# EAGLE schematic jobygnss_v2.1_final (EAGLE 5.11)

## Sheet 1 of 3
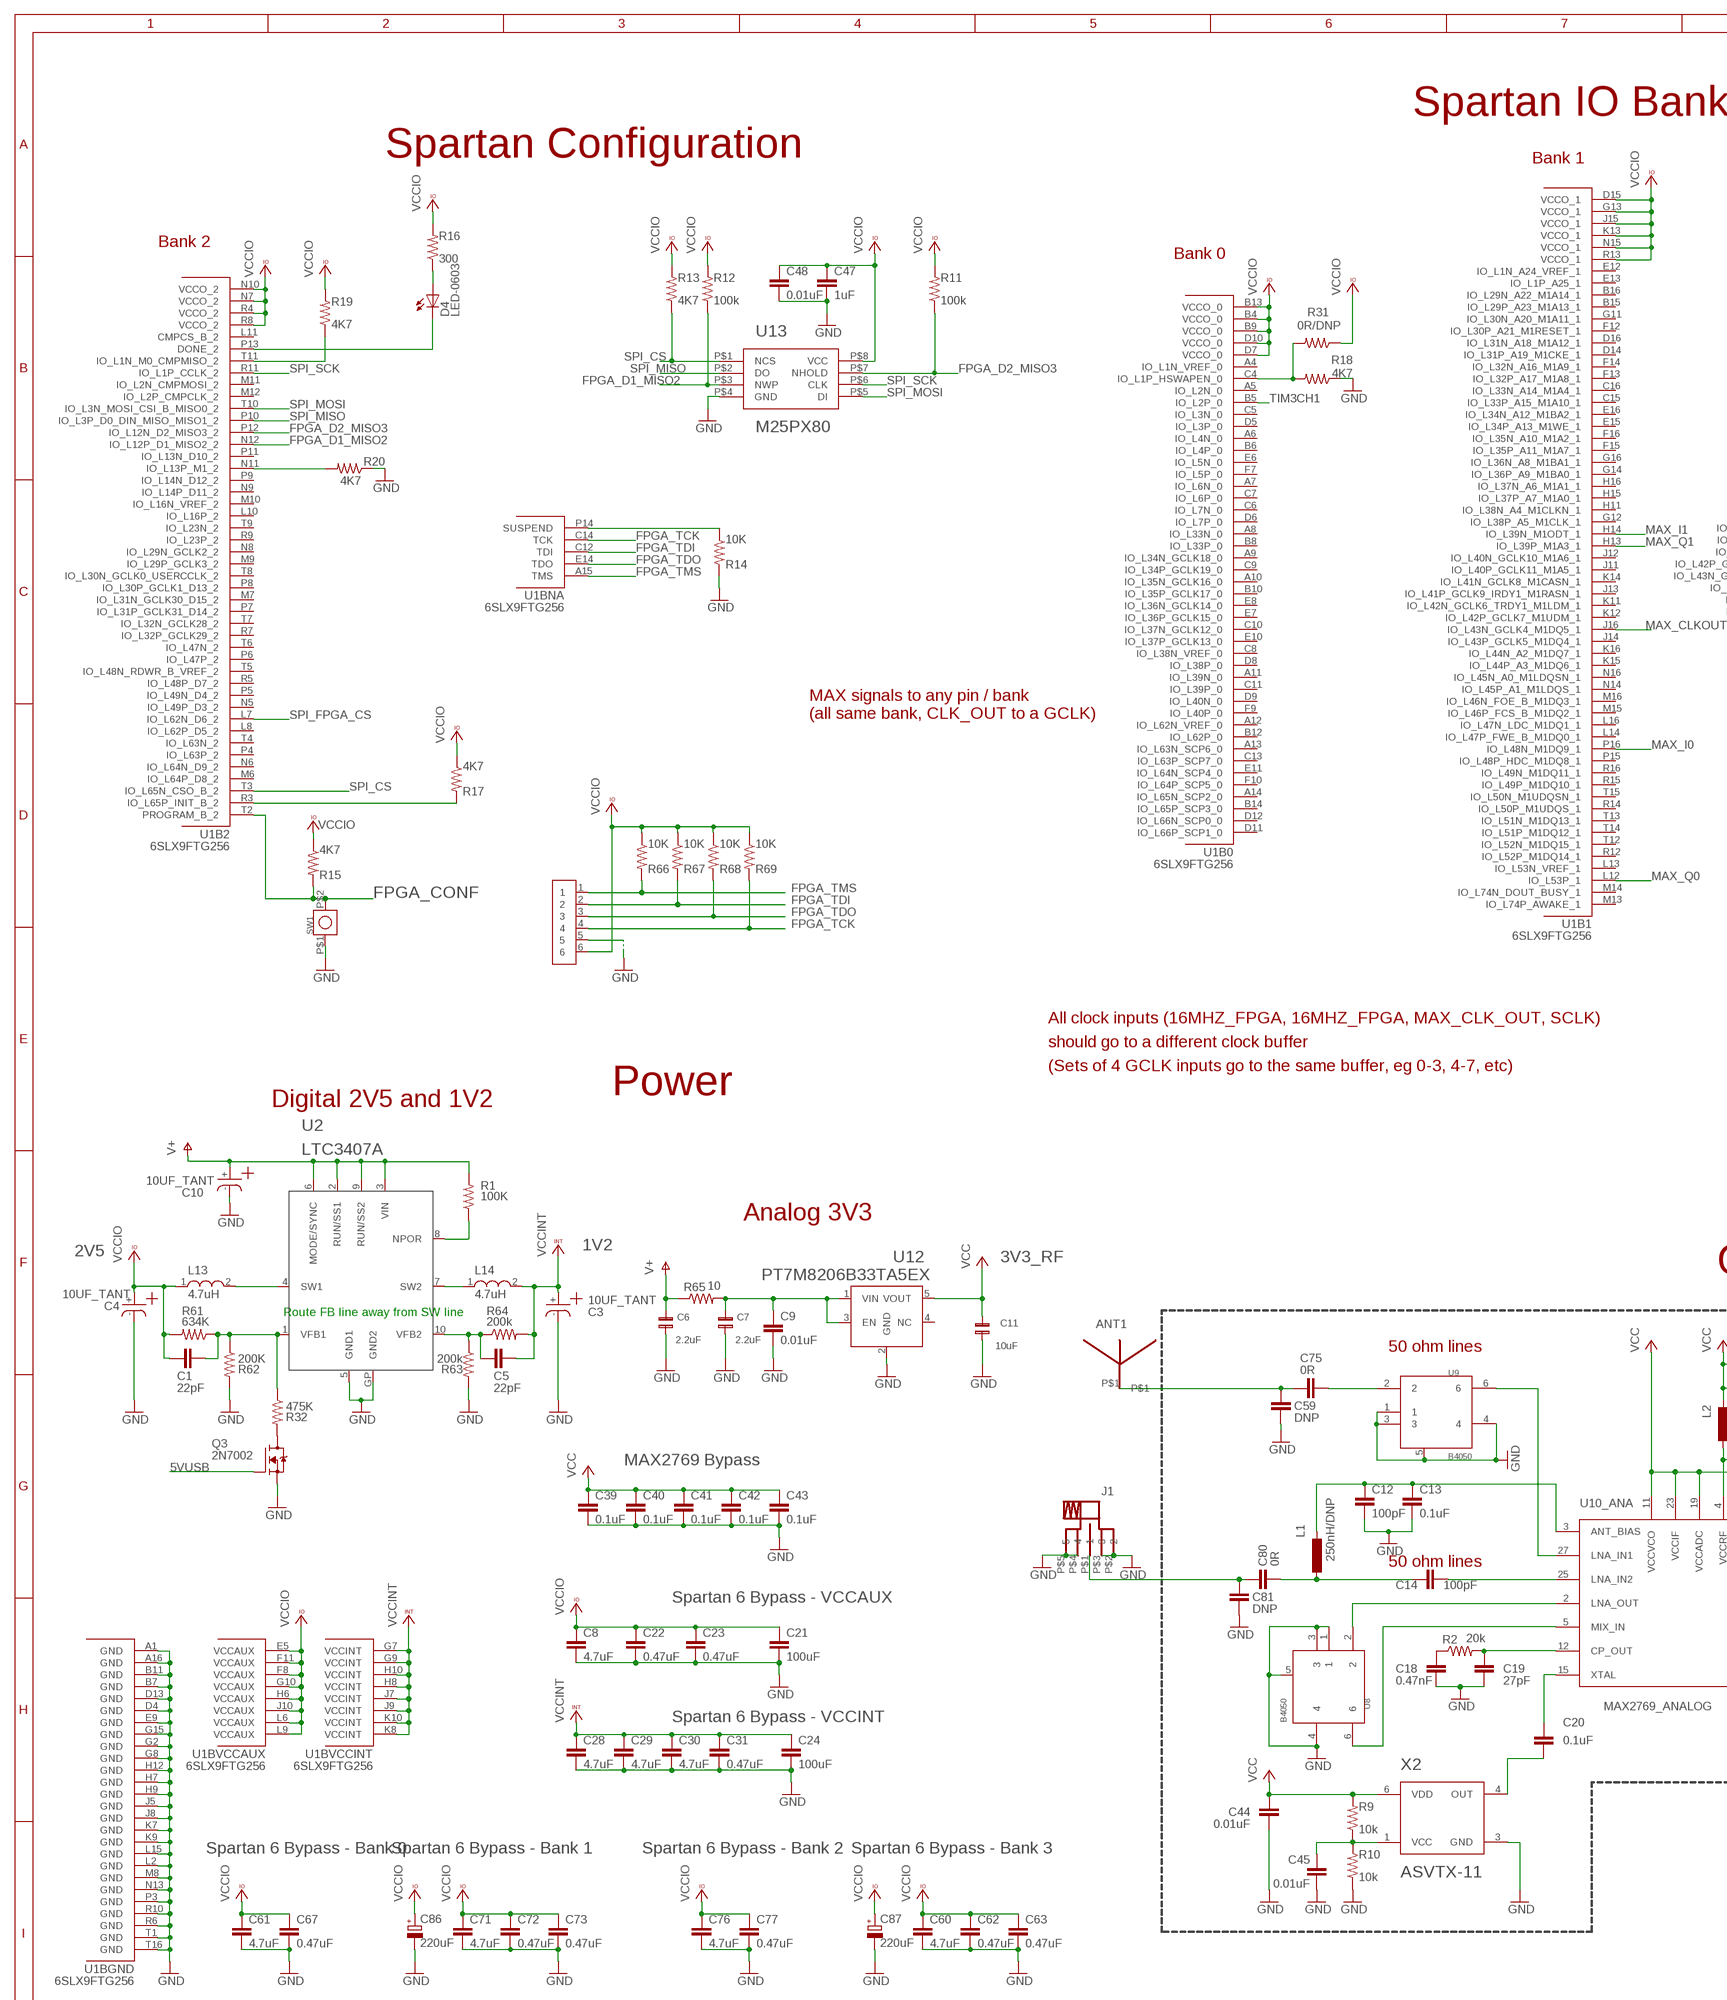
[diagram p0: schematic, sheet 1, part 1 of 2]
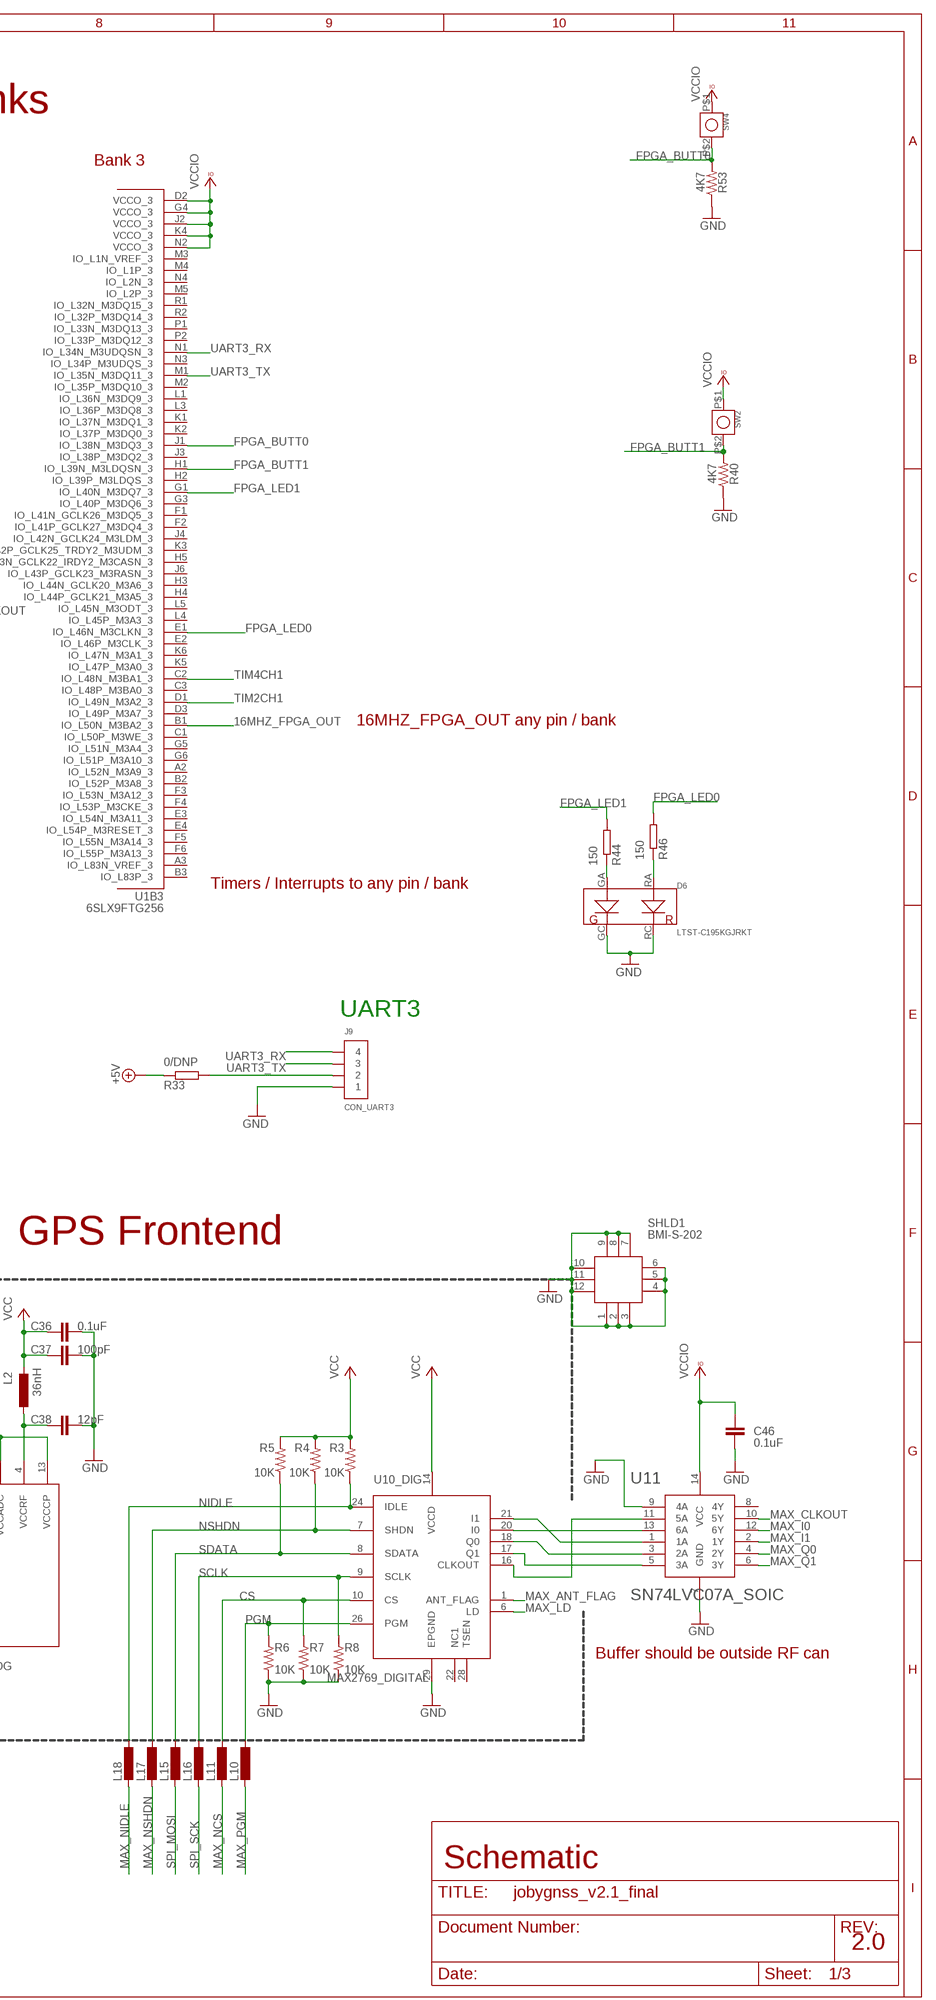
[diagram p1: schematic, sheet 1, part 2 of 2]

### Parts
ANT1  GPS_PATCH_ANTENNA  [GPS_PATCH_ANTENNA]
C1  22pF  C-EUC0402  [C0402]
C3  10UF_TANT  [CT7343]
C4  10UF_TANT  [CT7343]
C5  22pF  C-EUC0402  [C0402]
C6  2.2uF  C0603  [0603]
C7  2.2uF  C0603  [0603]
C8  4.7uF  C-EUC0603K  [C0603K]
C9  0.01uF  C-EUC0402  [C0402]
C10  10UF_TANT  [CT7343]
C11  10uF  C0603  [0603]
C12  100pF  C-EUC0402  [C0402]
C13  0.1uF  C-EUC0402  [C0402]
C14  100pF  C-EUC0402  [C0402]
C18  0.47nF  C-EUC0402  [C0402]
C19  27pF  C-EUC0402  [C0402]
C20  0.1uF  C-EUC0402  [C0402]
C21  100uF  C-EUC1210K  [C1210K]
C22  0.47uF  C-EUC0402  [C0402]
C23  0.47uF  C-EUC0402  [C0402]
C24  100uF  C-EUC1210K  [C1210K]
C28  4.7uF  C-EUC0603K  [C0603K]
C29  4.7uF  C-EUC0603K  [C0603K]
C30  4.7uF  C-EUC0603K  [C0603K]
C31  0.47uF  C-EUC0402  [C0402]
C36  0.1uF  C-EUC0402  [C0402]
C37  100pF  C-EUC0402  [C0402]
C38  12pF  C-EUC0402  [C0402]
C39  0.1uF  C-EUC0402  [C0402]
C40  0.1uF  C-EUC0402  [C0402]
C41  0.1uF  C-EUC0402  [C0402]
C42  0.1uF  C-EUC0402  [C0402]
C43  0.1uF  C-EUC0402  [C0402]
C44  0.01uF  C-EUC0402  [C0402]
C45  0.01uF  C-EUC0402  [C0402]
C46  0.1uF  C-EUC0402  [C0402]
C47  1uF  C-EUC0402  [C0402]
C48  0.01uF  C-EUC0402  [C0402]
C59  DNP  C-EUC0402  [C0402]
C60  4.7uF  C-EUC0603K  [C0603K]
C61  4.7uF  C-EUC0603K  [C0603K]
C62  0.47uF  C-EUC0402  [C0402]
C63  0.47uF  C-EUC0402  [C0402]
C67  0.47uF  C-EUC0402  [C0402]
C71  4.7uF  C-EUC0603K  [C0603K]
C72  0.47uF  C-EUC0402  [C0402]
C73  0.47uF  C-EUC0402  [C0402]
C75  0R  C-EUC0402  [C0402]
C76  4.7uF  C-EUC0603K  [C0603K]
C77  0.47uF  C-EUC0402  [C0402]
C80  0R  C-EUC0402  [C0402]
C81  DNP  C-EUC0402  [C0402]
C86  220uF  CAPACITOR-POLC  [6032/C]
C87  220uF  CAPACITOR-POLC  [6032/C]
D4  LED-0603  [0603-LED]
D6  LTST-C195KGJRKT  [LTST-C195KGJRKT]
J1  SMA  [SMA]
J2  6_PIN_100MIL  [SSW-106-02-S-S]
J9  CON_UART3  CONN_4-1-53398  [PB-53398-04]
L1  250nH/DNP  INDUCTOR-0402  [0402-IND]
L2  36nH  INDUCTOR-0402  [0402-IND]
L10  INDUCTOR-0402  [0402-IND]
L11  INDUCTOR-0402  [0402-IND]
L13  4.7uH  LQM2HPN4R7MG0L  [LQM2HPN4R7MG0L]
L14  4.7uH  LQM2HPN4R7MG0L  [LQM2HPN4R7MG0L]
L15  INDUCTOR-0402  [0402-IND]
L16  INDUCTOR-0402  [0402-IND]
L17  INDUCTOR-0402  [0402-IND]
L18  INDUCTOR-0402  [0402-IND]
Q3  2N7002  [2N7002]
R1  100K  R-US_R0402  [R0402]
R2  20k  R-US_R0402  [R0402]
R3  10K  R-US_R0402  [R0402]
R4  10K  R-US_R0402  [R0402]
R5  10K  R-US_R0402  [R0402]
R6  10K  R-US_R0402  [R0402]
R7  10K  R-US_R0402  [R0402]
R8  10K  R-US_R0402  [R0402]
R9  10k  R-US_R0402  [R0402]
R10  10k  R-US_R0402  [R0402]
R11  100k  R-US_R0402  [R0402]
R12  100k  R-US_R0402  [R0402]
R13  4K7  R-US_R0402  [R0402]
R14  10K  R-US_R0402  [R0402]
R15  4K7  R-US_R0402  [R0402]
R16  300  R-US_R0402  [R0402]
R17  4K7  R-US_R0402  [R0402]
R18  4K7  R-US_R0402  [R0402]
R19  4K7  R-US_R0402  [R0402]
R20  4K7  R-US_R0402  [R0402]
R31  0R/DNP  R-US_R0402  [R0402]
R32  475K  R-US_R0402  [R0402]
R33  0/DNP  RESISTOR-0402  [0402-RES]
R40  4K7  R-US_R0402  [R0402]
R44  150  RESISTOR-0402  [0402-RES]
R46  150  RESISTOR-0402  [0402-RES]
R53  4K7  R-US_R0402  [R0402]
R61  634K  R-US_R0402  [R0402]
R62  200K  R-US_R0402  [R0402]
R63  200k  R-US_R0402  [R0402]
R64  200k  R-US_R0402  [R0402]
R65  10  R-US_R0402  [R0402]
R66  10K  R-US_R0402  [R0402]
R67  10K  R-US_R0402  [R0402]
R68  10K  R-US_R0402  [R0402]
R69  10K  R-US_R0402  [R0402]
SHLD1  BMI-S-202  [BMI-S-202]
SW1  B3U-1000P  [B3U-1000P]
SW2  B3U-1000P  [B3U-1000P]
SW4  B3U-1000P  [B3U-1000P]
U1  6SLX9FTG256  [FT256]
U2  LTC3407A  [MSOP10]
U8  B4050  [B4050]
U9  B4050  [B4050]
U10  MAX2769  [MAX2769]
U11  SN74LVC07A_SOIC  [SN74LVC07A_SOIC]
U12  PT7M8206B33TA5EX  [PT7M8206B33TA5EX]
U13  M25PX80  M25P80-VMW6TG  [M25P]
X2  ASVTX-11  [ASVTX-11]

### Nets
5VUSB: Q3.G ; also sheet 3
16MHZ_FPGA_OUT: U1.B1(B3:IO_L50N_M3BA2_3) ; also sheet 3
+5V: R33.P$1 ; also sheet 3
CS: L11.P$1 R7.2 U10.10(_DIG:CS)
FE_CLK: C20.2 X2.4(OUT)
FPGA_BUTT0: R53.2 SW4.P$2 U1.J1(B3:IO_L38N_M3DQ3_3)
FPGA_BUTT1: R40.2 SW2.P$2 U1.H1(B3:IO_L39N_M3LDQSN_3)
FPGA_CONF: R15.2 SW1.P$2 U1.T2(B2:PROGRAM_B_2) ; also sheet 3
FPGA_D1_MISO2: R12.1 U1.N12(B2:IO_L12P_D1_MISO2_2) U13.P$3(NWP)
FPGA_D2_MISO3: R11.1 U1.P12(B2:IO_L12N_D2_MISO3_2) U13.P$7(NHOLD)
FPGA_LED0: R46.P$2 U1.E1(B3:IO_L46N_M3CLKN_3)
FPGA_LED1: R44.P$2 U1.G1(B3:IO_L40N_M3DQ7_3)
FPGA_M0: R19.1 U1.T11(B2:IO_L1N_M0_CMPMISO_2)
FPGA_M1: R20.2 U1.N11(B2:IO_L13P_M1_2)
FPGA_TCK: J2.4 R69.2 U1.C14(BNA:TCK)
FPGA_TDI: J2.2 R67.2 U1.C12(BNA:TDI)
FPGA_TDO: J2.3 R68.2 U1.E14(BNA:TDO)
FPGA_TMS: J2.1 R66.2 U1.A15(BNA:TMS)
GND: C3.- C4.- C6.1 C7.1 C8.2 C9.2 C10.- C11.1 C12.2 C13.2 C18.2 C19.2 C21.2 C22.2 C23.2 C24.2 C28.2 C29.2 C30.2 C31.2 C36.2 C37.2 C38.2 C39.2 C40.2 C41.2 C42.2 C43.2 C44.2 C45.2 C46.2 C47.2 C48.2 C59.1 C60.2 C61.2 C62.2 C63.2 C67.2 C71.2 C72.2 C73.2 C76.2 C77.2 C81.1 C86.- C87.- D6.GC D6.RC J1.P$2 J1.P$3 J1.P$4 J1.P$5 J2.5 J9.1 Q3.S R6.1 R7.1 R8.1 R10.1 R14.2 R18.1 R20.1 R40.1 R53.1 R62.2 R63.2 SHLD1.1 SHLD1.2 SHLD1.3 SHLD1.4 SHLD1.5 SHLD1.6 SHLD1.7 SHLD1.8 SHLD1.9 SHLD1.10 SHLD1.11 SHLD1.12 SW1.P$1 U1.A1(BGND:GND) U1.A16(BGND:GND) U1.B7(BGND:GND) U1.B11(BGND:GND) U1.D4(BGND:GND) U1.D13(BGND:GND) U1.E9(BGND:GND) U1.G2(BGND:GND) U1.G8(BGND:GND) U1.G15(BGND:GND) U1.H7(BGND:GND) U1.H9(BGND:GND) U1.H12(BGND:GND) U1.J5(BGND:GND) U1.J8(BGND:GND) U1.K7(BGND:GND) U1.K9(BGND:GND) U1.L2(BGND:GND) U1.L15(BGND:GND) U1.M8(BGND:GND) U1.N13(BGND:GND) U1.P3(BGND:GND) U1.R6(BGND:GND) U1.R10(BGND:GND) U1.T1(BGND:GND) U1.T16(BGND:GND) U2.5(GND1) U2.GP(GND2) U8.1 U8.3 U8.4 U8.5 U9.1 U9.3 U9.4 U9.5 U10.29(_DIG:EPGND) U11.7(GND) U11.9(4A) U12.2(GND) U13.P$4(GND) X2.3(GND) ; also sheet 3
MAX_ANT_FLAG: U10.1(_DIG:ANT_FLAG) ; also sheet 3
MAX_CLKOUT: U1.J16(B1:IO_L43N_GCLK4_M1DQ5_1) U11.10(5Y)
MAX_I0: U1.P16(B1:IO_L48N_M1DQ9_1) U11.12(6Y)
MAX_I1: U1.H14(B1:IO_L39N_M1ODT_1) U11.2(1Y)
MAX_LD: U10.6(_DIG:LD) ; also sheet 3
MAX_NCS: L11.P$2 ; also sheet 3
MAX_NIDLE: L18.P$2 ; also sheet 3
MAX_NSHDN: L17.P$2 ; also sheet 3
MAX_PGM: L10.P$2 ; also sheet 3
MAX_Q0: U1.L12(B1:IO_L53P_1) U11.4(2Y)
MAX_Q1: U1.H13(B1:IO_L39P_M1A3_1) U11.6(3Y)
N$3: C18.1 R2.1
N$4: C19.1 R2.2 U10.12(_ANA:CP_OUT)
N$5: U8.2 U10.2(_ANA:LNA_OUT)
N$6: C20.1 U10.15(_ANA:XTAL)
N$7: U8.6 U10.5(_ANA:MIX_IN)
N$8: C80.2 C81.2 J1.P$1
N$9: U10.18(_DIG:Q0) U11.3(2A)
N$10: C12.1 C13.1 L1.P$2 U10.3(_ANA:ANT_BIAS)
N$11: C75.1 U9.2
N$12: Q3.D R32.2
N$15: D4.C U1.P13(B2:DONE_2)
N$16: R1.1 U2.8(NPOR)
N$17: L13.2 U2.4(SW1)
N$18: J9.2 R33.P$2
N$19: D6.RA R46.P$1
N$20: U10.16(_DIG:CLKOUT) U11.11(5A)
N$21: U10.17(_DIG:Q1) U11.5(3A)
N$22: C38.1 L2.P$1 U10.4(_ANA:VCCRF)
N$23: D6.GA R44.P$1
N$26: L14.1 U2.7(SW2)
N$27: C45.1 R9.1 R10.2 X2.1(VCC)
N$28: U10.21(_DIG:I1) U11.1(1A)
N$29: U9.6 U10.27(_ANA:LNA_IN1)
N$30: C14.2 U10.25(_ANA:LNA_IN2)
N$31: R18.2 R31.2 U1.C4(B0:IO_L1P_HSWAPEN_0)
N$32: U10.20(_DIG:I0) U11.13(6A)
N$34: R14.1 U1.P14(BNA:SUSPEND)
N$41: D4.A R16.1
N$42: R17.2 U1.R3(B2:IO_L65P_INIT_B_2)
N$45: ANT1.P$1 C59.2 C75.2
N$46: C14.1 C80.1 L1.P$1
N$53: C1.1 R32.1 R61.1 R62.1 U2.1(VFB1)
N$54: C5.2 R63.1 R64.1 U2.10(VFB2)
N$56: C7.2 C9.1 R65.2 U12.1(VIN) U12.3(EN)
NIDLE: L18.P$1 R3.1 U10.24(_DIG:IDLE)
NSHDN: L17.P$1 R4.1 U10.7(_DIG:SHDN)
PGM: L10.P$1 R6.2 U10.26(_DIG:PGM)
SCLK: L16.P$1 R8.2 U10.9(_DIG:SCLK)
SDATA: L15.P$1 R5.1 U10.8(_DIG:SDATA)
SPI_CS: R13.1 U1.T3(B2:IO_L65N_CSO_B_2) U13.P$1(NCS) ; also sheet 3
SPI_FPGA_CS: U1.L7(B2:IO_L62N_D6_2) ; also sheet 3
SPI_MISO: U1.P10(B2:IO_L3P_D0_DIN_MISO_MISO1_2) U13.P$2(DO) ; also sheet 3
SPI_MOSI: L15.P$2 U1.T10(B2:IO_L3N_MOSI_CSI_B_MISO0_2) U13.P$5(DI) ; also sheet 3
SPI_SCK: L16.P$2 U1.R11(B2:IO_L1P_CCLK_2) U13.P$6(CLK) ; also sheet 3
TIM2CH1: U1.D1(B3:IO_L49N_M3A2_3) ; also sheet 3
TIM3CH1: U1.B5(B0:IO_L2P_0) ; also sheet 3
TIM4CH1: U1.C2(B3:IO_L48N_M3BA1_3) ; also sheet 3
UART3_RX: J9.4 U1.N1(B3:IO_L34N_M3UDQSN_3)
UART3_TX: J9.3 U1.M1(B3:IO_L35N_M3DQ11_3)
V+: C6.2 C10.+ R1.2 R65.1 U2.2(RUN/SS1) U2.3(VIN) U2.6(MODE/SYNC) U2.9(RUN/SS2) ; also sheet 3
VCC: C11.2 C36.1 C37.1 C39.1 C40.1 C41.1 C42.1 C43.1 C44.1 L2.P$2 R3.2 R4.2 R5.2 R9.2 U10.11(_ANA:VCCVCO) U10.13(_ANA:VCCCP) U10.14(_DIG:VCCD) U10.19(_ANA:VCCADC) U10.23(_ANA:VCCIF) U12.5(VOUT) X2.6(VDD)
VCCINT: C3.+ C5.1 C24.1 C28.1 C29.1 C30.1 C31.1 L14.2 R64.2 U1.G7(BVCCINT:VCCINT) U1.G9(BVCCINT:VCCINT) U1.H8(BVCCINT:VCCINT) U1.H10(BVCCINT:VCCINT) U1.J7(BVCCINT:VCCINT) U1.J9(BVCCINT:VCCINT) U1.K8(BVCCINT:VCCINT) U1.K10(BVCCINT:VCCINT)
VCCIO: C1.2 C4.+ C8.1 C21.1 C22.1 C23.1 C46.1 C47.1 C48.1 C60.1 C61.1 C62.1 C63.1 C67.1 C71.1 C72.1 C73.1 C76.1 C77.1 C86.+ C87.+ J2.6 L13.1 R11.2 R12.2 R13.2 R15.1 R16.2 R17.1 R19.2 R31.1 R61.2 R66.1 R67.1 R68.1 R69.1 SW2.P$1 SW4.P$1 U1.B4(B0:VCCO_0) U1.B9(B0:VCCO_0) U1.B13(B0:VCCO_0) U1.D2(B3:VCCO_3) U1.D7(B0:VCCO_0) U1.D10(B0:VCCO_0) U1.D15(B1:VCCO_1) U1.E5(BVCCAUX:VCCAUX) U1.F8(BVCCAUX:VCCAUX) U1.F11(BVCCAUX:VCCAUX) U1.G4(B3:VCCO_3) U1.G10(BVCCAUX:VCCAUX) U1.G13(B1:VCCO_1) U1.H6(BVCCAUX:VCCAUX) U1.J2(B3:VCCO_3) U1.J10(BVCCAUX:VCCAUX) U1.J15(B1:VCCO_1) U1.K4(B3:VCCO_3) U1.K13(B1:VCCO_1) U1.L6(BVCCAUX:VCCAUX) U1.L9(BVCCAUX:VCCAUX) U1.N2(B3:VCCO_3) U1.N7(B2:VCCO_2) U1.N10(B2:VCCO_2) U1.N15(B1:VCCO_1) U1.R4(B2:VCCO_2) U1.R8(B2:VCCO_2) U1.R13(B1:VCCO_1) U11.14(VCC) U13.P$8(VCC) ; also sheet 3
Unconnected: U1.A2(B3:IO_L52N_M3A9_3) U1.A3(B3:IO_L83N_VREF_3) U1.A4(B0:IO_L1N_VREF_0) U1.A5(B0:IO_L2N_0) U1.A6(B0:IO_L4N_0) U1.A7(B0:IO_L6N_0) U1.A8(B0:IO_L33N_0) U1.A9(B0:IO_L34N_GCLK18_0) U1.A10(B0:IO_L35N_GCLK16_0) U1.A11(B0:IO_L39N_0) U1.A12(B0:IO_L62N_VREF_0) U1.A13(B0:IO_L63N_SCP6_0) U1.A14(B0:IO_L65N_SCP2_0) U1.B2(B3:IO_L52P_M3A8_3) U1.B3(B3:IO_L83P_3) U1.B6(B0:IO_L4P_0) U1.B8(B0:IO_L33P_0) U1.B10(B0:IO_L35P_GCLK17_0) U1.B12(B0:IO_L62P_0) U1.B14(B0:IO_L65P_SCP3_0) U1.B15(B1:IO_L29P_A23_M1A13_1) U1.B16(B1:IO_L29N_A22_M1A14_1) U1.C1(B3:IO_L50P_M3WE_3) U1.C3(B3:IO_L48P_M3BA0_3) U1.C5(B0:IO_L3N_0) U1.C6(B0:IO_L7N_0) U1.C7(B0:IO_L6P_0) U1.C8(B0:IO_L38N_VREF_0) U1.C9(B0:IO_L34P_GCLK19_0) U1.C10(B0:IO_L37N_GCLK12_0) U1.C11(B0:IO_L39P_0) U1.C13(B0:IO_L63P_SCP7_0) U1.C15(B1:IO_L33P_A15_M1A10_1) U1.C16(B1:IO_L33N_A14_M1A4_1) U1.D3(B3:IO_L49P_M3A7_3) U1.D5(B0:IO_L3P_0) U1.D6(B0:IO_L7P_0) U1.D8(B0:IO_L38P_0) U1.D9(B0:IO_L40N_0) U1.D11(B0:IO_L66P_SCP1_0) U1.D12(B0:IO_L66N_SCP0_0) U1.D14(B1:IO_L31P_A19_M1CKE_1) U1.D16(B1:IO_L31N_A18_M1A12_1) U1.E2(B3:IO_L46P_M3CLK_3) U1.E3(B3:IO_L54N_M3A11_3) U1.E4(B3:IO_L54P_M3RESET_3) U1.E6(B0:IO_L5N_0) U1.E7(B0:IO_L36P_GCLK15_0) U1.E8(B0:IO_L36N_GCLK14_0) U1.E10(B0:IO_L37P_GCLK13_0) U1.E11(B0:IO_L64N_SCP4_0) U1.E12(B1:IO_L1N_A24_VREF_1) U1.E13(B1:IO_L1P_A25_1) U1.E15(B1:IO_L34P_A13_M1WE_1) U1.E16(B1:IO_L34N_A12_M1BA2_1) U1.F1(B3:IO_L41N_GCLK26_M3DQ5_3) U1.F2(B3:IO_L41P_GCLK27_M3DQ4_3) U1.F3(B3:IO_L53N_M3A12_3) U1.F4(B3:IO_L53P_M3CKE_3) U1.F5(B3:IO_L55N_M3A14_3) U1.F6(B3:IO_L55P_M3A13_3) U1.F7(B0:IO_L5P_0) U1.F9(B0:IO_L40P_0) U1.F10(B0:IO_L64P_SCP5_0) U1.F12(B1:IO_L30P_A21_M1RESET_1) U1.F13(B1:IO_L32P_A17_M1A8_1) U1.F14(B1:IO_L32N_A16_M1A9_1) U1.F15(B1:IO_L35P_A11_M1A7_1) U1.F16(B1:IO_L35N_A10_M1A2_1) U1.G3(B3:IO_L40P_M3DQ6_3) U1.G5(B3:IO_L51N_M3A4_3) U1.G6(B3:IO_L51P_M3A10_3) U1.G11(B1:IO_L30N_A20_M1A11_1) U1.G12(B1:IO_L38P_A5_M1CLK_1) U1.G14(B1:IO_L36P_A9_M1BA0_1) U1.G16(B1:IO_L36N_A8_M1BA1_1) U1.H2(B3:IO_L39P_M3LDQS_3) U1.H3(B3:IO_L44N_GCLK20_M3A6_3) U1.H4(B3:IO_L44P_GCLK21_M3A5_3) U1.H5(B3:IO_L43N_GCLK22_IRDY2_M3CASN_3) U1.H11(B1:IO_L38N_A4_M1CLKN_1) U1.H15(B1:IO_L37P_A7_M1A0_1) U1.H16(B1:IO_L37N_A6_M1A1_1) U1.J3(B3:IO_L38P_M3DQ2_3) U1.J4(B3:IO_L42N_GCLK24_M3LDM_3) U1.J6(B3:IO_L43P_GCLK23_M3RASN_3) U1.J11(B1:IO_L40P_GCLK11_M1A5_1) U1.J12(B1:IO_L40N_GCLK10_M1A6_1) U1.J13(B1:IO_L41P_GCLK9_IRDY1_M1RASN_1) U1.J14(B1:IO_L43P_GCLK5_M1DQ4_1) U1.K1(B3:IO_L37N_M3DQ1_3) U1.K2(B3:IO_L37P_M3DQ0_3) U1.K3(B3:IO_L42P_GCLK25_TRDY2_M3UDM_3) U1.K5(B3:IO_L47P_M3A0_3) U1.K6(B3:IO_L47N_M3A1_3) U1.K11(B1:IO_L42N_GCLK6_TRDY1_M1LDM_1) U1.K12(B1:IO_L42P_GCLK7_M1UDM_1) U1.K14(B1:IO_L41N_GCLK8_M1CASN_1) U1.K15(B1:IO_L44P_A3_M1DQ6_1) U1.K16(B1:IO_L44N_A2_M1DQ7_1) U1.L1(B3:IO_L36N_M3DQ9_3) U1.L3(B3:IO_L36P_M3DQ8_3) U1.L4(B3:IO_L45P_M3A3_3) U1.L5(B3:IO_L45N_M3ODT_3) U1.L8(B2:IO_L62P_D5_2) U1.L10(B2:IO_L16P_2) U1.L11(B2:CMPCS_B_2) U1.L13(B1:IO_L53N_VREF_1) U1.L14(B1:IO_L47P_FWE_B_M1DQ0_1) U1.L16(B1:IO_L47N_LDC_M1DQ1_1) U1.M2(B3:IO_L35P_M3DQ10_3) U1.M3(B3:IO_L1N_VREF_3) U1.M4(B3:IO_L1P_3) U1.M5(B3:IO_L2P_3) U1.M6(B2:IO_L64P_D8_2) U1.M7(B2:IO_L31N_GCLK30_D15_2) U1.M9(B2:IO_L29P_GCLK3_2) U1.M10(B2:IO_L16N_VREF_2) U1.M11(B2:IO_L2N_CMPMOSI_2) U1.M12(B2:IO_L2P_CMPCLK_2) U1.M13(B1:IO_L74P_AWAKE_1) U1.M14(B1:IO_L74N_DOUT_BUSY_1) U1.M15(B1:IO_L46P_FCS_B_M1DQ2_1) U1.M16(B1:IO_L46N_FOE_B_M1DQ3_1) U1.N3(B3:IO_L34P_M3UDQS_3) U1.N4(B3:IO_L2N_3) U1.N5(B2:IO_L49P_D3_2) U1.N6(B2:IO_L64N_D9_2) U1.N8(B2:IO_L29N_GCLK2_2) U1.N9(B2:IO_L14P_D11_2) U1.N14(B1:IO_L45P_A1_M1LDQS_1) U1.N16(B1:IO_L45N_A0_M1LDQSN_1) U1.P1(B3:IO_L33N_M3DQ13_3) U1.P2(B3:IO_L33P_M3DQ12_3) U1.P4(B2:IO_L63P_2) U1.P5(B2:IO_L49N_D4_2) U1.P6(B2:IO_L47P_2) U1.P7(B2:IO_L31P_GCLK31_D14_2) U1.P8(B2:IO_L30P_GCLK1_D13_2) U1.P9(B2:IO_L14N_D12_2) U1.P11(B2:IO_L13N_D10_2) U1.P15(B1:IO_L48P_HDC_M1DQ8_1) U1.R1(B3:IO_L32N_M3DQ15_3) U1.R2(B3:IO_L32P_M3DQ14_3) U1.R5(B2:IO_L48P_D7_2) U1.R7(B2:IO_L32P_GCLK29_2) U1.R9(B2:IO_L23P_2) U1.R12(B1:IO_L52P_M1DQ14_1) U1.R14(B1:IO_L50P_M1UDQS_1) U1.R15(B1:IO_L49P_M1DQ10_1) U1.R16(B1:IO_L49N_M1DQ11_1) U1.T4(B2:IO_L63N_2) U1.T5(B2:IO_L48N_RDWR_B_VREF_2) U1.T6(B2:IO_L47N_2) U1.T7(B2:IO_L32N_GCLK28_2) U1.T8(B2:IO_L30N_GCLK0_USERCCLK_2) U1.T9(B2:IO_L23N_2) U1.T12(B1:IO_L52N_M1DQ15_1) U1.T13(B1:IO_L51N_M1DQ13_1) U1.T14(B1:IO_L51P_M1DQ12_1) U1.T15(B1:IO_L50N_M1UDQSN_1) U10.22(_DIG:NC1) U10.28(_DIG:TSEN) U11.8(4Y) U12.4(NC)

### Notes on the sheet
- Spartan IO Banks
- Spartan Configuration
- Bank 1
- Bank 3
- Bank 2
- Bank 0
- MAX signals to any pin / bank
- (all same bank, CLK_OUT to a GCLK)
- 16MHZ_FPGA_OUT any pin / bank
- Timers / Interrupts to any pin / bank
- All clock inputs (16MHZ_FPGA, 16MHZ_FPGA, MAX_CLK_OUT, SCLK) | UART3
- should go to a different clock buffer
- (Sets of 4 GCLK inputs go to the same buffer, eg 0-3, 4-7, etc)
- Power
- Digital 2V5 and 1V2
- Analog 3V3
- 1V2
- 2V5
- 3V3_RF
- GPS Frontend
- Route FB line away from SW line
- 50 ohm lines
- MAX2769 Bypass
- 50 ohm lines
- Spartan 6 Bypass - VCCAUX
- Buffer should be outside RF can
- Spartan 6 Bypass - VCCINT
- Spartan 6 Bypass - Bank 0 | Spartan 6 Bypass - Bank 1 | Spartan 6 Bypass - Bank 2 | Spartan 6 Bypass - Bank 3
- Schematic
- 2.0

## Sheet 2 of 3
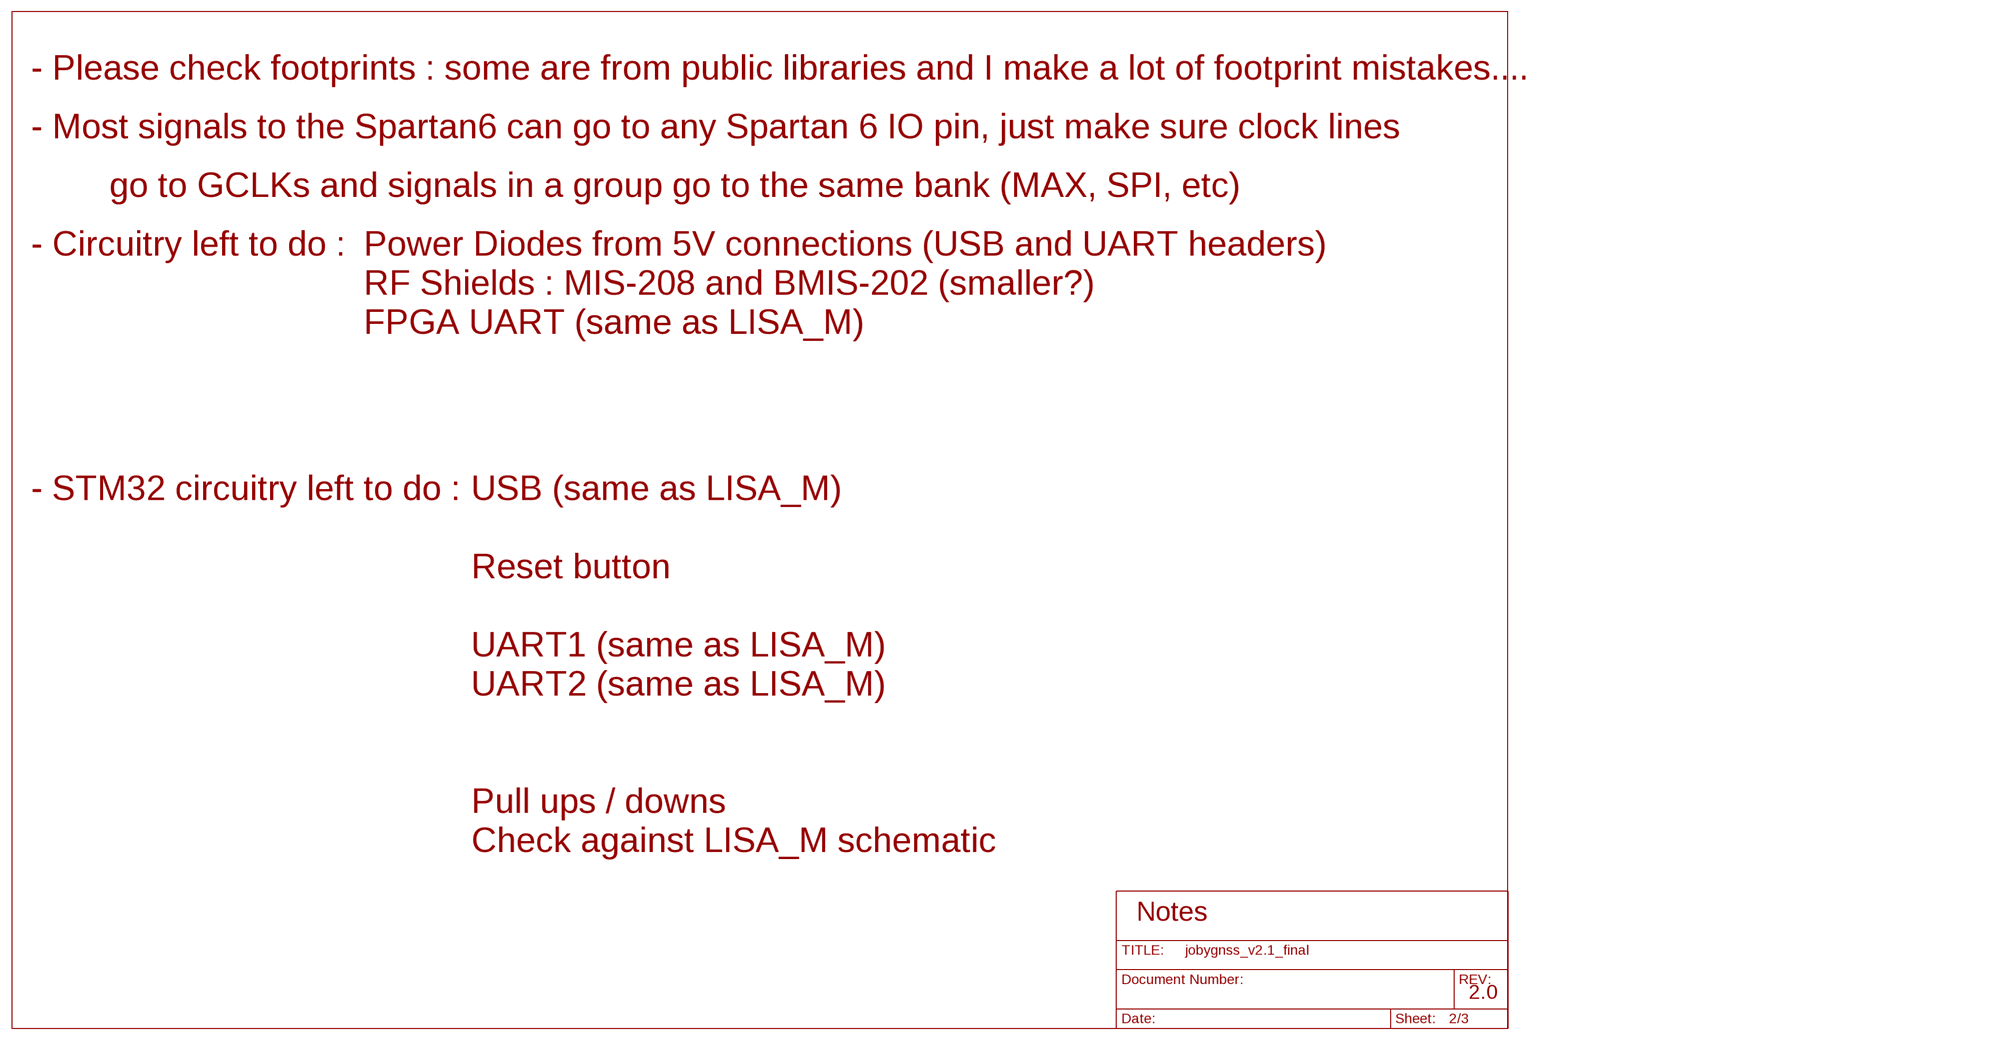
[diagram p2: schematic, sheet 2]

### Notes on the sheet
- - Please check footprints : some are from public libraries and I make a lot of footprint mistakes....
- - Most signals to the Spartan6 can go to any Spartan 6 IO pin, just make sure clock lines
- go to GCLKs and signals in a group go to the same bank (MAX, SPI, etc)
- - Circuitry left to do : | Power Diodes from 5V connections (USB and UART headers)
- RF Shields : MIS-208 and BMIS-202 (smaller?)
- FPGA UART (same as LISA_M)
- - STM32 circuitry left to do : | USB (same as LISA_M)
- Reset button
- UART1 (same as LISA_M)
- UART2 (same as LISA_M)
- Pull ups / downs
- Check against LISA_M schematic
- Notes
- 2.0

## Sheet 3 of 3
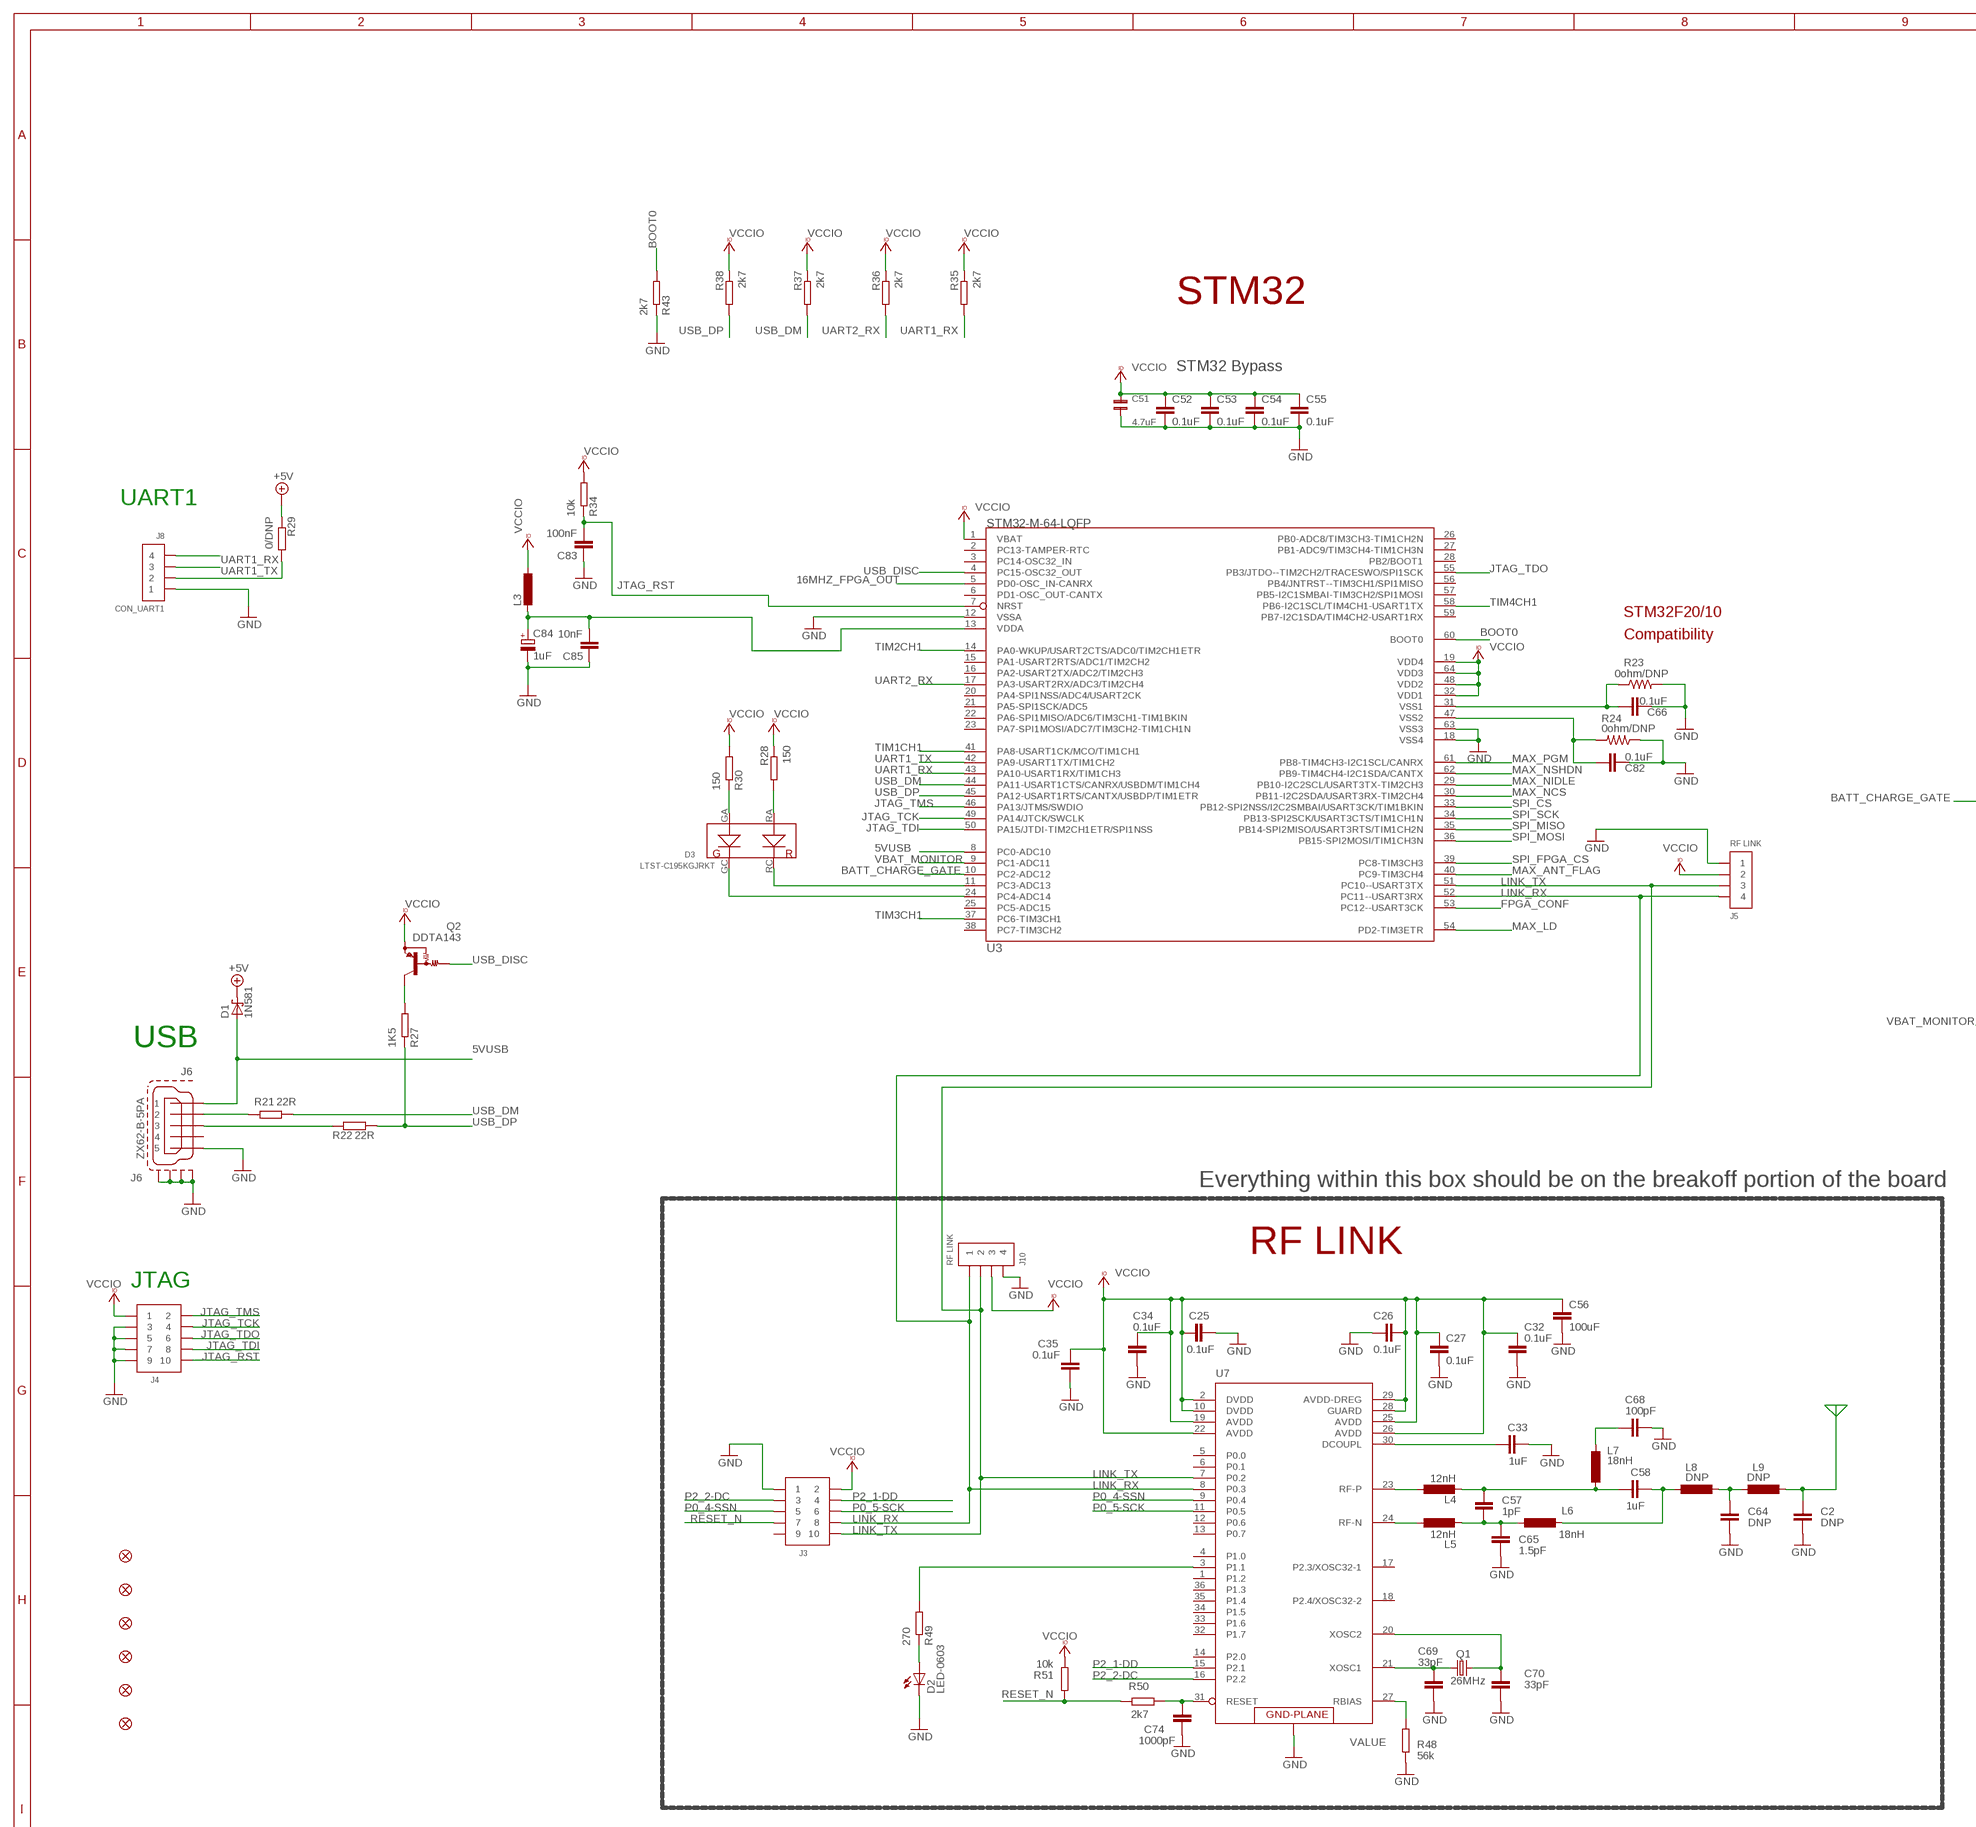
[diagram p3: schematic, sheet 3, part 1 of 2]
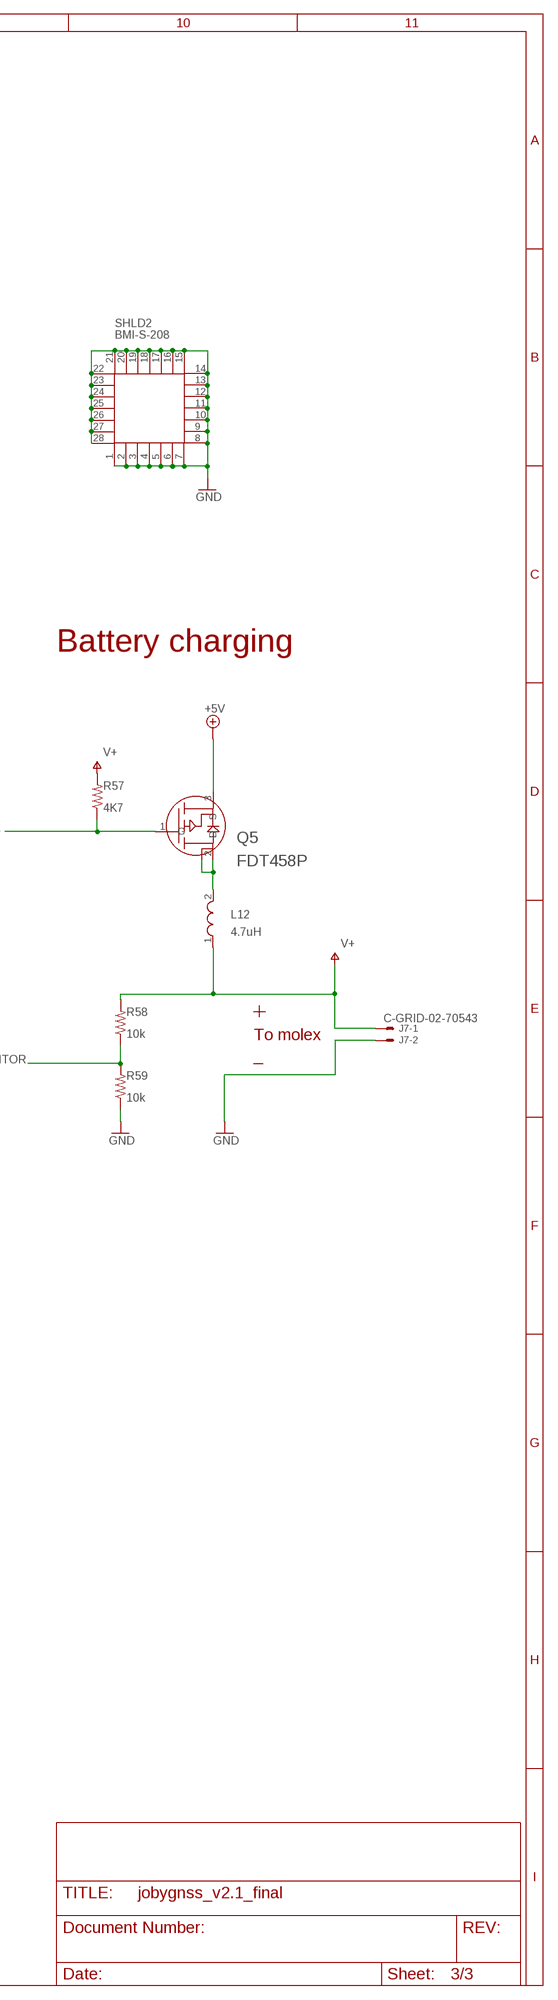
[diagram p4: schematic, sheet 3, part 2 of 2]

### Parts
C2  DNP  C-EUC0402  [C0402]
C25  0.1uF  C-EUC0402  [C0402]
C26  0.1uF  C-EUC0402  [C0402]
C27  0.1uF  C-EUC0402  [C0402]
C32  0.1uF  C-EUC0402  [C0402]
C33  1uF  C-EUC0402  [C0402]
C34  0.1uF  C-EUC0402  [C0402]
C35  0.1uF  C-EUC0402  [C0402]
C51  4.7uF  C0603  [0603]
C52  0.1uF  C-EUC0402  [C0402]
C53  0.1uF  C-EUC0402  [C0402]
C54  0.1uF  C-EUC0402  [C0402]
C55  0.1uF  C-EUC0402  [C0402]
C56  100uF  C-EUC1210K  [C1210K]
C57  1pF  C-EUC0402  [C0402]
C58  1uF  C-EUC0402  [C0402]
C64  DNP  C-EUC0402  [C0402]
C65  1.5pF  C-EUC0402  [C0402]
C66  0.1uF  C-EUC0402  [C0402]
C68  100pF  C-EUC0402  [C0402]
C69  33pF  C-EUC0402  [C0402]
C70  33pF  C-EUC0402  [C0402]
C74  1000pF  C-EUC0402  [C0402]
C82  0.1uF  C-EUC0402  [C0402]
C83  100nF  CAPACITOR-0402  [0402-CAP]
C84  1uF  CAPACITOR-POL-1206  [1206-POL-CAP]
C85  10nF  CAPACITOR-0402  [0402-CAP]
D1  1N581  [SOD-123_MINI-SMA]
D2  LED-0603  [0603-LED]
D3  LTST-C195KGJRKT  [LTST-C195KGJRKT]
J3  DEBUG HDR  CONN_5-2-FTSH-V  [FTSH-105-DV]
J4  PIN_HDR_EDG_1.27MM_5-2  CONN_5-2-FTSH-V  [FTSH-105-DV]
J5  RF LINK  CONN_4-1-53398  [PB-53398-04]
J6  ZX62-B-5PA  [ZX62-B-5PA]
J7  C-GRID-02-70543  [70543-02]
J8  CON_UART1  CONN_4-1-53398  [PB-53398-04]
J10  RF LINK  CONN_4-1-53398  [PB-53398-04]
JP5  FIDUCIAL1.5X3  [FIDUCIAL-1.5X3]
JP6  FIDUCIAL1.5X3  [FIDUCIAL-1.5X3]
JP7  FIDUCIAL1.5X3  [FIDUCIAL-1.5X3]
JP8  FIDUCIAL1.5X3  [FIDUCIAL-1.5X3]
JP9  FIDUCIAL1.5X3  [FIDUCIAL-1.5X3]
JP10  FIDUCIAL1.5X3  [FIDUCIAL-1.5X3]
L3  INDUCTOR-0603  [0603-IND]
L4  12nH  INDUCTOR-0402  [0402-IND]
L5  12nH  INDUCTOR-0402  [0402-IND]
L6  18nH  INDUCTOR-0402  [0402-IND]
L7  18nH  INDUCTOR-0402  [0402-IND]
L8  DNP  INDUCTOR-0402  [0402-IND]
L9  DNP  INDUCTOR-0402  [0402-IND]
L12  4.7uH  LQM2HPN4R7MG0L  [LQM2HPN4R7MG0L]
Q1  26MHz  CRYSTALHC49UP  [HC49UP]
Q2  DDTA143  MUN2111SOT23  [SOT23]
Q5  FDT458P  [FDT458P_SOT223]
R21  22R  RESISTOR-0402  [0402-RES]
R22  22R  RESISTOR-0402  [0402-RES]
R23  0ohm/DNP  R-US_R0402  [R0402]
R24  0ohm/DNP  R-US_R0402  [R0402]
R27  1K5  RESISTOR-0402  [0402-RES]
R28  150  RESISTOR-0402  [0402-RES]
R29  0/DNP  RESISTOR-0402  [0402-RES]
R30  150  RESISTOR-0402  [0402-RES]
R34  10k  RESISTOR-0402  [0402-RES]
R35  2k7  RESISTOR-0402  [0402-RES]
R36  2k7  RESISTOR-0402  [0402-RES]
R37  2k7  RESISTOR-0402  [0402-RES]
R38  2k7  RESISTOR-0402  [0402-RES]
R43  2k7  RESISTOR-0402  [0402-RES]
R48  56k  RESISTOR-0402  [0402-RES]
R49  270  RESISTOR-0402  [0402-RES]
R50  2k7  RESISTOR-0402  [0402-RES]
R51  10k  RESISTOR-0402  [0402-RES]
R57  4K7  R-US_R0402  [R0402]
R58  10k  R-US_R0402  [R0402]
R59  10k  R-US_R0402  [R0402]
SHLD2  BMI-S-208  [BMI-S-208]
U3  STM32-M-64-LQFP  [LQFP64]
U7  CC1110  [QFN50P595X595X90-37N]

### Nets
5VUSB: D1.A J6.PIN_1 U3.8(PC0-ADC10) ; also sheet 1
16MHZ_FPGA_OUT: U3.5(PD0-OSC_IN-CANRX) ; also sheet 1
+5V: D1.C Q5.3(S) R29.P$1 ; also sheet 1
BATT_CHARGE_GATE: Q5.1(G) R57.1 U3.10(PC2-ADC12)
BOOT0: R43.P$2 U3.60(BOOT0)
FPGA_CONF: U3.53(PC12--USART3CK) ; also sheet 1
FT_USB_DM: J6.PIN_2 R21.P$1
FT_USB_DP: J6.PIN_3 R22.P$1
GND: C2.2 C25.2 C26.2 C27.2 C32.2 C33.2 C34.2 C35.2 C51.1 C52.2 C53.2 C54.2 C55.2 C56.2 C64.2 C65.2 C66.2 C68.2 C69.2 C70.2 C74.2 C82.1 C83.P$1 C84.- C85.P$1 D2.C J3.1 J4.3 J4.5 J4.7 J4.9 J5.1 J6.GND_LEFT(S1) J6.GND_RIGHT(S2) J6.GND_UP_LEFT(S3) J6.GND_UP_RIGHT(S4) J6.PIN_5 J7.2 J8.1 J10.4 R23.2 R24.1 R43.P$1 R48.P$2 R59.1 SHLD2.1 SHLD2.2 SHLD2.3 SHLD2.4 SHLD2.5 SHLD2.6 SHLD2.7 SHLD2.8 SHLD2.9 SHLD2.10 SHLD2.11 SHLD2.12 SHLD2.13 SHLD2.14 SHLD2.15 SHLD2.16 SHLD2.17 SHLD2.18 SHLD2.19 SHLD2.20 SHLD2.21 SHLD2.22 SHLD2.23 SHLD2.24 SHLD2.25 SHLD2.26 SHLD2.27 SHLD2.28 U3.12(VSSA) U3.18(VSS4) U3.63(VSS3) U7.37(GND) ; also sheet 1
JTAG_RST: C83.P$2 J4.10 R34.P$1 U3.7(NRST)
JTAG_TCK: J4.4 U3.49(PA14/JTCK/SWCLK)
JTAG_TDI: J4.8 U3.50(PA15/JTDI-TIM2CH1ETR/SPI1NSS)
JTAG_TDO: J4.6 U3.55(PB3/JTDO--TIM2CH2/TRACESWO/SPI1SCK)
JTAG_TMS: J4.2 U3.46(PA13/JTMS/SWDIO)
LINK_RX: J3.8 J5.4 J10.1 U3.52(PC11--USART3RX) U7.8(P0.3)
LINK_TX: J3.10 J5.3 J10.2 U3.51(PC10--USART3TX) U7.7(P0.2)
MAX_ANT_FLAG: U3.40(PC9-TIM3CH4) ; also sheet 1
MAX_LD: U3.54(PD2-TIM3ETR) ; also sheet 1
MAX_NCS: U3.30(PB11-I2C2SDA/USART3RX-TIM2CH4) ; also sheet 1
MAX_NIDLE: U3.29(PB10-I2C2SCL/USART3TX-TIM2CH3) ; also sheet 1
MAX_NSHDN: U3.62(PB9-TIM4CH4-I2C1SDA/CANTX) ; also sheet 1
MAX_PGM: U3.61(PB8-TIM4CH3-I2C1SCL/CANRX) ; also sheet 1
N$1: Q2.3(C) R27.P$2
N$2: J8.2 R29.P$2
N$24: D3.GA R30.P$1
N$25: L12.2 Q5.2(D) Q5.4(TAB)
N$33: C57.2 C65.1 L5.P$2 L6.P$1
N$35: C33.1 U7.30(DCOUPL)
N$36: C57.1 C58.1 L4.P$2 L7.P$1
N$37: L4.P$1 U7.23(RF-P)
N$38: L5.P$1 U7.24(RF-N)
N$39: D3.GC U3.24(PC4-ADC14)
N$40: C69.1 Q1.1 U7.21(XOSC1)
N$43: C58.2 L6.P$2 L8.P$2
N$44: C64.1 L8.P$1 L9.P$2
N$47: C68.1 L7.P$2
N$48: C70.1 Q1.2 U7.20(XOSC2)
N$49: R48.P$1 U7.27(RBIAS)
N$50: D2.A R49.P$1
N$51: C2.1 L9.P$1
N$52: C74.1 R50.P$2 U7.31(RESET)
N$55: D3.RA R28.P$2
N$59: D3.RC U3.11(PC3-ADC13)
P0_4-SSN: J3.5 U7.9(P0.4)
P0_5-SCK: J3.6 U7.11(P0.5)
P1_1-LED: R49.P$2 U7.3(P1.1)
P2_1-DD: J3.4 U7.15(P2.1)
P2_2-DC: J3.3 U7.16(P2.2)
RESET_N: J3.7 R50.P$1 R51.P$1
SPI_CS: U3.33(PB12-SPI2NSS/I2C2SMBAI/USART3CK/TIM1BKIN) ; also sheet 1
SPI_FPGA_CS: U3.39(PC8-TIM3CH3) ; also sheet 1
SPI_MISO: U3.35(PB14-SPI2MISO/USART3RTS/TIM1CH2N) ; also sheet 1
SPI_MOSI: U3.36(PB15-SPI2MOSI/TIM1CH3N) ; also sheet 1
SPI_SCK: U3.34(PB13-SPI2SCK/USART3CTS/TIM1CH1N) ; also sheet 1
TIM1CH1: U3.41(PA8-USART1CK/MCO/TIM1CH1)
TIM2CH1: U3.14(PA0-WKUP/USART2CTS/ADC0/TIM2CH1ETR) ; also sheet 1
TIM3CH1: U3.37(PC6-TIM3CH1) ; also sheet 1
TIM4CH1: U3.58(PB6-I2C1SCL/TIM4CH1-USART1TX) ; also sheet 1
UART1_RX: J8.4 R35.P$2 U3.43(PA10-USART1RX/TIM1CH3)
UART1_TX: J8.3 U3.42(PA9-USART1TX/TIM1CH2)
UART2_RX: R36.P$2 U3.17(PA3-USART2RX/ADC3/TIM2CH4)
USB_DISC: Q2.1(B) U3.4(PC15-OSC32_OUT)
USB_DM: R21.P$2 R37.P$2 U3.44(PA11-USART1CTS/CANRX/USBDM/TIM1CH4)
USB_DP: R22.P$2 R27.P$1 R38.P$2 U3.45(PA12-USART1RTS/CANTX/USBDP/TIM1ETR)
V+: J7.1 L12.1 R57.2 R58.2 ; also sheet 1
VBAT_MONITOR: R58.1 R59.2 U3.9(PC1-ADC11)
VCCIO: C25.1 C26.1 C27.1 C32.1 C34.1 C35.1 C51.2 C52.1 C53.1 C54.1 C55.1 C56.1 J3.2 J4.1 J5.2 J10.3 L3.P$1 Q2.2(E) R28.P$1 R30.P$2 R34.P$2 R35.P$1 R36.P$1 R37.P$1 R38.P$1 R51.P$2 U3.1(VBAT) U3.19(VDD4) U3.32(VDD1) U3.48(VDD2) U3.64(VDD3) U7.2(DVDD) U7.10(DVDD) U7.19(AVDD) U7.22(AVDD) U7.25(AVDD) U7.26(AVDD) U7.28(GUARD) U7.29(AVDD-DREG) ; also sheet 1
VDDA: C84.+ C85.P$2 L3.P$2 U3.13(VDDA)
VSS1: C66.1 R23.1 U3.31(VSS1)
VSS2: C82.2 R24.2 U3.47(VSS2)
Unconnected: J3.9 J6.PIN_4 U3.2(PC13-TAMPER-RTC) U3.3(PC14-OSC32_IN) U3.6(PD1-OSC_OUT-CANTX) U3.15(PA1-USART2RTS/ADC1/TIM2CH2) U3.16(PA2-USART2TX/ADC2/TIM2CH3) U3.20(PA4-SPI1NSS/ADC4/USART2CK) U3.21(PA5-SPI1SCK/ADC5) U3.22(PA6-SPI1MISO/ADC6/TIM3CH1-TIM1BKIN) U3.23(PA7-SPI1MOSI/ADC7/TIM3CH2-TIM1CH1N) U3.25(PC5-ADC15) U3.26(PB0-ADC8/TIM3CH3-TIM1CH2N) U3.27(PB1-ADC9/TIM3CH4-TIM1CH3N) U3.28(PB2/BOOT1) U3.38(PC7-TIM3CH2) U3.56(PB4/JNTRST--TIM3CH1/SPI1MISO) U3.57(PB5-I2C1SMBAI-TIM3CH2/SPI1MOSI) U3.59(PB7-I2C1SDA/TIM4CH2-USART1RX) U7.1(P1.2) U7.4(P1.0) U7.5(P0.0) U7.6(P0.1) U7.12(P0.6) U7.13(P0.7) U7.14(P2.0) U7.17(P2.3/XOSC32-1) U7.18(P2.4/XOSC32-2) U7.32(P1.7) U7.33(P1.6) U7.34(P1.5) U7.35(P1.4) U7.36(P1.3)

### Notes on the sheet
- STM32
- STM32 Bypass
- UART1
- STM32F20/10
- Battery charging
- Compatibility
- To molex
- USB
- Everything within this box should be on the breakoff portion of the board
- RF LINK
- JTAG

## Library data of the parts
ANT1 = joby_robotics:GPS_PATCH_ANTENNA
C1 C2 C5 C8 C9 C12-C14 C18-C48 C52-C77 C80-C82 = rcl:C-EU: CAPACITOR, European symbol
C3 C4 C10 = jobygnss:10UF_TANT
C6 C7 C11 C51 = capsmd:C0603
C83 C85 = pel_dipol_comp:CAPACITOR
C84 C86 C87 = pel_dipol_comp:CAPACITOR-POL
D1 = jobygnss:1N581*: 1.0A SCHOTTKY BARRIER RECTIFIER Source: http://www.diodes.com/datasheets/ds23001.pdf
D2 D4 = pel_dipol_comp:LED
D3 D6 = jobygnss:LTST-C195KGJRKT
J1 = joby_robotics:SMA
J2 = jobygnss:6_PIN_100MIL
J3 J4 = pel_misc:CONN_5-2
J5 J8-J10 = pel_molex:CONN_4-1
J6 = open-bldc:ZX62-B-5PA
J7 = jobygnss:C-GRID-02: CONNECTOR wire to board 2.54 mm (0.100") pitch header
JP5-JP10 = aspirin:FIDUCIAL: Fiducial Alignment Points Various fiducial points for machine vision alignment.
L1 L2 L4-L11 L15-L18 = pel_dipol_comp:INDUCTOR
L3 = res_cap:INDUCTOR
L12-L14 = jobygnss:LQM2HPN4R7MG0L
Q1 = crystal:CRYSTAL: CRYSTAL
Q2 = transistor-pnp:MUN2111*: PNP Bias Resistor Transistor
Q3 = jobygnss:2N7002
Q5 = jobygnss:FDT458P
R1-R20 R23 R24 R31 R32 R40 R53 R57-R59 R61-R69 = rcl:R-US_: RESISTOR, American symbol
R21 R22 R27-R30 R33-R38 R43 R44 R46 R48-R51 = pel_dipol_comp:RESISTOR
SHLD1 = jobygnss:BMI-S-202
SHLD2 = jobygnss:BMI-S-208
SW1 SW2 SW4 = jobygnss:B3U-1000P
U1 = xilinx_devices:6SLX9FTG256: Xilinx FPGA: 6SLX9FTG256
U2 = jobygnss:LTC3407A
U3 = pel_stm32:STM32-M-64-LQFP: STM32F103 Medium Density 64pin LQFP
U7 = chipcon-ti-v2:CC1110: True System-on-Chip with Low Power RF Transceiver and 8051 MCU
U8 U9 = jobygnss:B4050
U10 = jobygnss:MAX2769
U11 = jobygnss:SN74LVC07A_SOIC
U12 = jobygnss:PT7M8206B33TA5EX
U13 = jobygnss:M25P80-VMW6TG
X2 = jobygnss:ASVTX-11